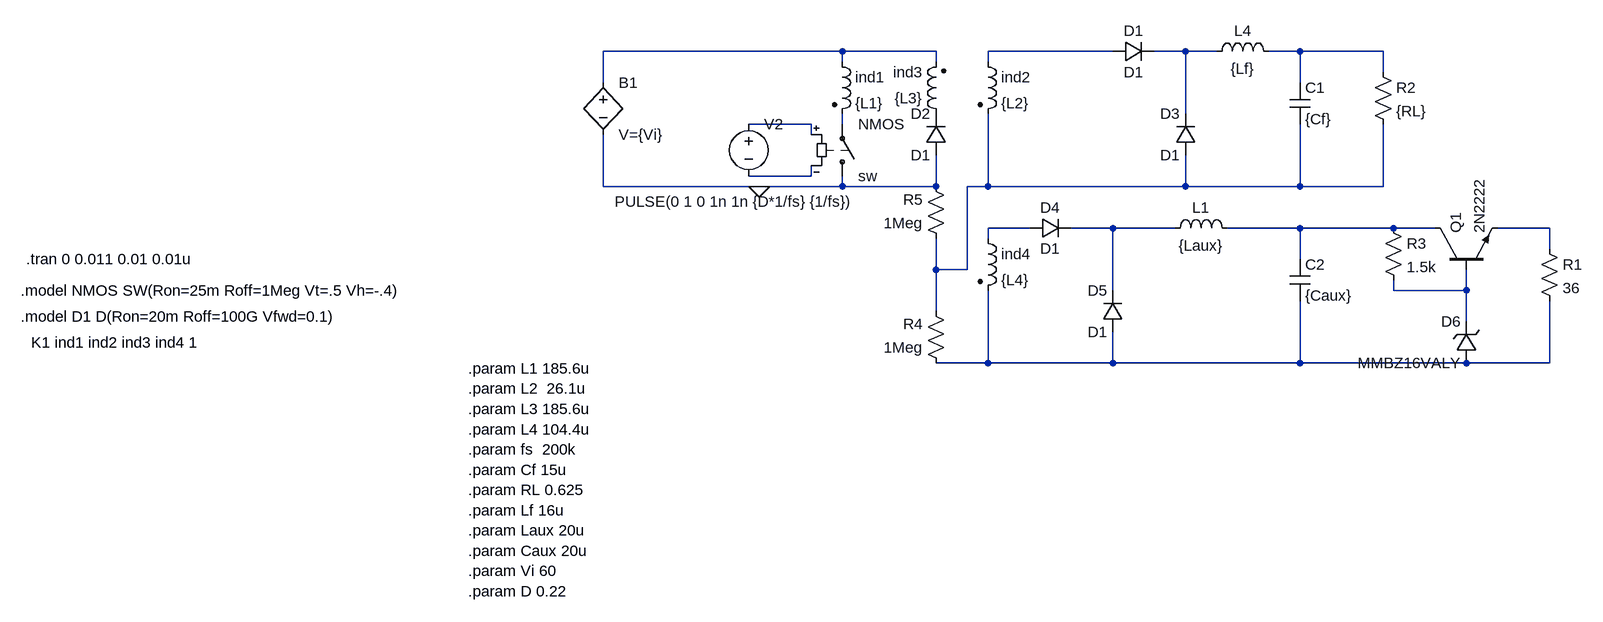
[diagram p0: schematic Forward-Converter.asc]
Forward-Converter.asc, the LTspice schematic file:
Version 4
SHEET 1 1704 908
WIRE 320 96 -48 96
WIRE 464 96 320 96
WIRE 736 96 544 96
WIRE 848 96 800 96
WIRE 896 96 848 96
WIRE 1024 96 976 96
WIRE 1152 96 1024 96
WIRE 320 112 320 96
WIRE 464 112 464 96
WIRE 544 112 544 96
WIRE 1152 128 1152 96
WIRE -48 144 -48 96
WIRE 1024 144 1024 96
WIRE 848 192 848 96
WIRE 272 208 176 208
WIRE 320 208 320 192
WIRE 272 224 272 208
WIRE 272 288 272 272
WIRE 272 288 176 288
WIRE -48 304 -48 224
WIRE 192 304 -48 304
WIRE 320 304 320 288
WIRE 320 304 192 304
WIRE 464 304 464 256
WIRE 464 304 320 304
WIRE 544 304 544 192
WIRE 544 304 512 304
WIRE 848 304 848 256
WIRE 848 304 544 304
WIRE 1024 304 1024 208
WIRE 1024 304 848 304
WIRE 1152 304 1152 208
WIRE 1152 304 1024 304
WIRE 608 368 544 368
WIRE 736 368 672 368
WIRE 832 368 736 368
WIRE 1024 368 912 368
WIRE 1168 368 1024 368
WIRE 1232 368 1168 368
WIRE 1408 368 1328 368
WIRE 544 384 544 368
WIRE 1408 400 1408 368
WIRE 1024 416 1024 368
WIRE 464 432 464 384
WIRE 512 432 512 304
WIRE 512 432 464 432
WIRE 736 464 736 368
WIRE 1168 464 1168 448
WIRE 1280 464 1280 432
WIRE 1280 464 1168 464
WIRE 464 496 464 432
WIRE 1280 512 1280 464
WIRE 544 576 544 464
WIRE 544 576 464 576
WIRE 736 576 736 528
WIRE 736 576 544 576
WIRE 1024 576 1024 480
WIRE 1024 576 736 576
WIRE 1280 576 1024 576
WIRE 1408 576 1408 480
WIRE 1408 576 1280 576
FLAG 192 304 0
SYMBOL res 1136 112 R0
SYMATTR InstName R2
SYMATTR Value {RL}
SYMBOL cap 1008 144 R0
SYMATTR InstName C1
SYMATTR Value {Cf}
SYMATTR SpiceLine Rser=2m
SYMBOL voltage 176 192 R0
WINDOW 123 0 0 Left 0
WINDOW 39 0 0 Left 0
WINDOW 3 -206 135 Left 2
SYMATTR Value PULSE(0 1 0 1n 1n {D*1/fs} {1/fs})
SYMATTR InstName V2
SYMBOL diode 480 256 R180
WINDOW 0 24 64 Left 2
WINDOW 3 24 0 Left 2
SYMATTR InstName D2
SYMATTR Value D1
SYMBOL diode 736 112 R270
WINDOW 0 32 32 VTop 2
WINDOW 3 0 32 VBottom 2
SYMATTR InstName D1
SYMATTR Value D1
SYMBOL diode 864 256 R180
WINDOW 0 24 64 Left 2
WINDOW 3 24 0 Left 2
SYMATTR InstName D3
SYMATTR Value D1
SYMBOL ind 880 112 R270
WINDOW 0 32 56 VTop 2
WINDOW 3 5 56 VBottom 2
SYMATTR InstName L4
SYMATTR Value {Lf}
SYMATTR SpiceLine Rser=50m
SYMBOL ind2 480 208 R180
WINDOW 0 36 80 Left 2
WINDOW 3 36 40 Left 2
SYMATTR InstName ind3
SYMATTR Value {L3}
SYMATTR Type ind
SYMATTR SpiceLine Rser=20m
SYMBOL ind2 528 96 R0
SYMATTR InstName ind2
SYMATTR Value {L2}
SYMATTR Type ind
SYMATTR SpiceLine Rser=20m
SYMBOL ind2 304 96 R0
SYMATTR InstName ind1
SYMATTR Value {L1}
SYMATTR Type ind
SYMATTR SpiceLine Rser=20m
SYMBOL sw 320 304 M180
SYMATTR InstName sw
SYMATTR Value NMOS
SYMBOL bv -48 128 R0
SYMATTR InstName B1
SYMATTR Value V={Vi}
SYMBOL res 1392 384 R0
SYMATTR InstName R1
SYMATTR Value 36
SYMBOL cap 1008 416 R0
SYMATTR InstName C2
SYMATTR Value {Caux}
SYMATTR SpiceLine Rser=2m
SYMBOL diode 608 384 R270
WINDOW 0 32 32 VTop 2
WINDOW 3 0 32 VBottom 2
SYMATTR InstName D4
SYMATTR Value D1
SYMBOL ind2 528 368 R0
SYMATTR InstName ind4
SYMATTR Value {L4}
SYMATTR Type ind
SYMATTR SpiceLine Rser=20m
SYMBOL npn 1232 432 R270
SYMATTR InstName Q1
SYMATTR Value 2N2222
SYMBOL res 1152 352 R0
SYMATTR InstName R3
SYMATTR Value 1.5k
SYMBOL zener 1296 576 R180
WINDOW 0 24 64 Left 2
WINDOW 3 24 0 Left 2
SYMATTR InstName D6
SYMATTR Value MMBZ16VALY
SYMBOL res 480 592 R180
WINDOW 0 36 76 Left 2
WINDOW 3 36 40 Left 2
SYMATTR InstName R4
SYMATTR Value 1Meg
SYMBOL res 480 400 R180
WINDOW 0 36 76 Left 2
WINDOW 3 36 40 Left 2
SYMATTR InstName R5
SYMATTR Value 1Meg
SYMBOL diode 752 528 R180
WINDOW 0 24 64 Left 2
WINDOW 3 24 0 Left 2
SYMATTR InstName D5
SYMATTR Value D1
SYMBOL ind 816 384 R270
WINDOW 0 32 56 VTop 2
WINDOW 3 5 56 VBottom 2
SYMATTR InstName L1
SYMATTR Value {Laux}
SYMATTR SpiceLine Rser=50m
TEXT -944 464 Left 2 !.model NMOS SW(Ron=25m Roff=1Meg Vt=.5 Vh=-.4)
TEXT -944 504 Left 2 !.model D1 D(Ron=20m Roff=100G Vfwd=0.1)
TEXT -936 416 Left 2 !.tran 0 0.011 0.01 0.01u
TEXT -928 544 Left 2 !K1 ind1 ind2 ind3 ind4 1
TEXT -256 584 Left 2 !.param L1 185.6u\n.param L2  26.1u \n.param L3 185.6u\n.param L4 104.4u\n.param fs  200k\n.param Cf 15u\n.param RL 0.625\n.param Lf 16u\n.param Laux 20u\n.param Caux 20u\n.param Vi 60\n.param D 0.22

The netlist it stands for:
* Forward-Converter.asc
R2 N004 N008 {RL}
C1 N004 N008 {Cf} Rser=2m
V2 N005 N007 PULSE(0 1 0 1n 1n {D*1/fs} {1/fs})
D2 0 P001 D1
D1 N002 N003 D1
D3 N008 N003 D1
L4 N003 N004 {Lf} Rser=50m
L§ind3 P001 N001 {L3} Rser=20m
L§ind2 N002 N008 {L2} Rser=20m
L§ind1 N001 N006 {L1} Rser=20m
sw 0 N006 N005 N007 NMOS
B1 N001 0 V={Vi}
R1 N012 N014 36
C2 N011 N014 {Caux} Rser=2m
D4 N009 N010 D1
L§ind4 N009 N014 {L4} Rser=20m
Q1 N011 N013 N012 0 2N2222
R3 N011 N013 1.5k
D6 N014 N013 MMBZ16VALY
R4 N014 N008 1Meg
R5 N008 0 1Meg
D5 N014 N010 D1
L1 N010 N011 {Laux} Rser=50m
.model D D
.lib standard.dio
.model NPN NPN
.model PNP PNP
.lib standard.bjt
.model NMOS SW(Ron=25m Roff=1Meg Vt=.5 Vh=-.4)
.model D1 D(Ron=20m Roff=100G Vfwd=0.1)
.tran 0 0.011 0.01 0.01u
K1 ind1 ind2 ind3 ind4 1
.param L1 185.6u
.param L2  26.1u
.param L3 185.6u
.param L4 104.4u
.param fs  200k
.param Cf 15u
.param RL 0.625
.param Lf 16u
.param Laux 20u
.param Caux 20u
.param Vi 60
.param D 0.22
.backanno
.end